# EAGLE design SUSTAINA-Power-Distribution-Board (EAGLE 9.6.2)
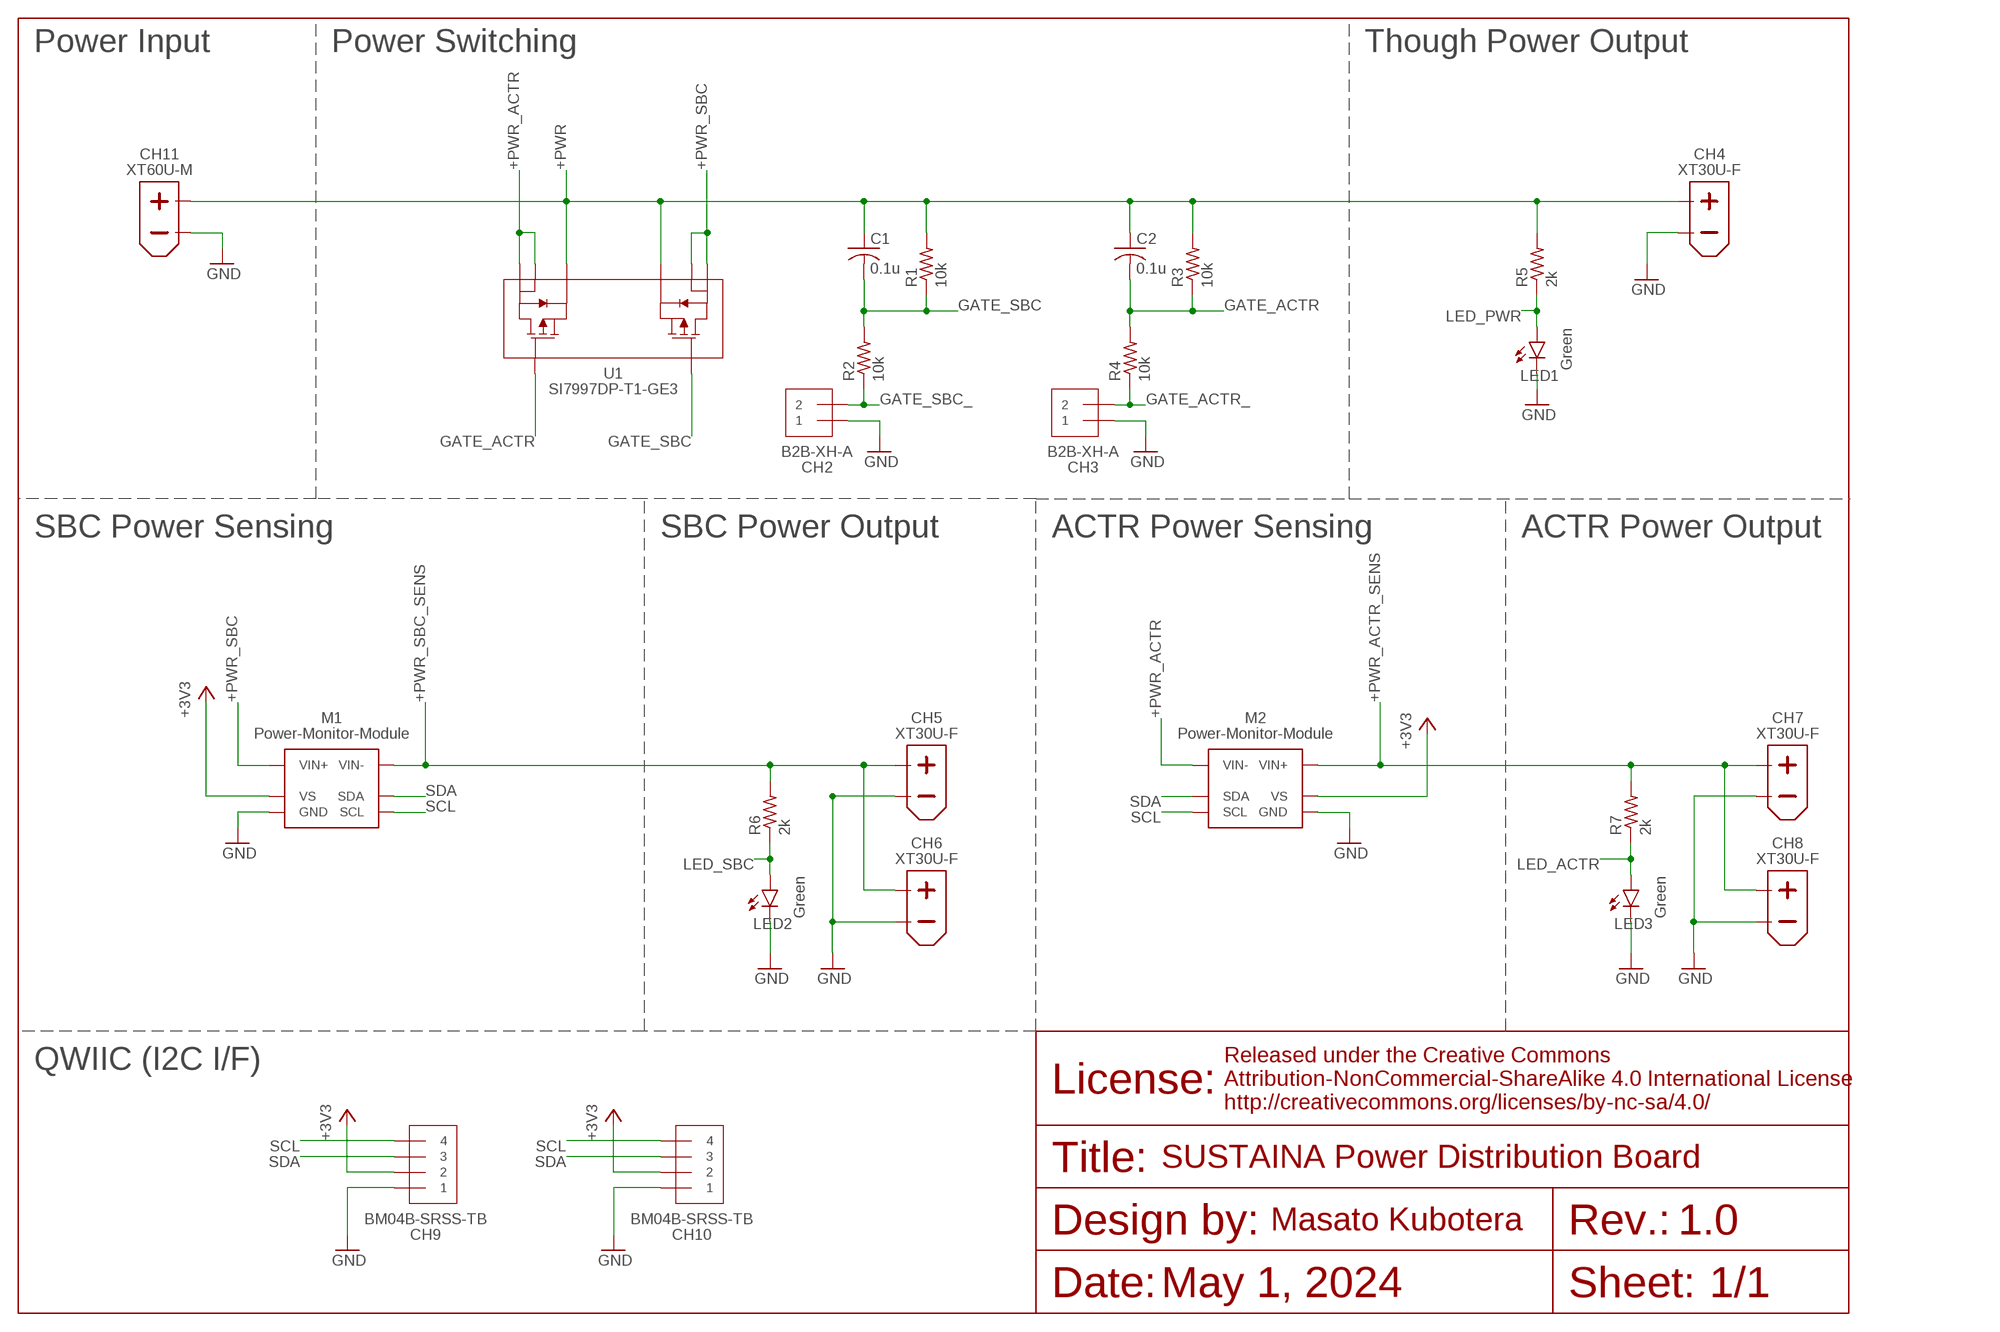
[diagram p0: schematic, sheet 1]

## Parts
C1  0.1u  C-USC0603  [C0603]
C2  0.1u  C-USC0603  [C0603]
CH2  B2B-XH-A  [B2B-XH-A]
CH3  B2B-XH-A  [B2B-XH-A]
CH4  XT30U-F  [XT30U-F]
CH5  XT30U-F  [XT30U-F]
CH6  XT30U-F  [XT30U-F]
CH7  XT30U-F  [XT30U-F]
CH8  XT30U-F  [XT30U-F]
CH9  BM04B-SRSS-TB  [BM04B-SRSS-TB]
CH10  BM04B-SRSS-TB  [BM04B-SRSS-TB]
CH11  XT60U-M  [XT60U-M]
LED1  Green  LEDSML0603  [SML0603]
LED2  Green  LEDSML0603  [SML0603]
LED3  Green  LEDSML0603  [SML0603]
M1  POWER-MONITOR-MODULE  [POWER-MONITOR-MODULE]
M2  POWER-MONITOR-MODULE  [POWER-MONITOR-MODULE]
R1  10k  R-US_R0603  [R0603]
R2  10k  R-US_R0603  [R0603]
R3  10k  R-US_R0603  [R0603]
R4  10k  R-US_R0603  [R0603]
R5  2k  R-US_R0603  [R0603]
R6  2k  R-US_R0603  [R0603]
R7  2k  R-US_R0603  [R0603]
U1  SI7997DP-T1-GE3  [POWERPAK_SO-8_VIS]

## Nets
+3V3 [low-power]: CH9.2 CH10.2 M1.VS M2.VS
+PWR [power]: C1.1 C2.1 CH4.+ CH11.+ R1.2 R3.2 R5.2 U1.1(S1) U1.3(S2)
+PWR_ACTR [power]: M2.VIN-1(VIN-) M2.VIN-2(VIN-) M2.VIN-3(VIN-) M2.VIN-4(VIN-) M2.VIN-5(VIN-) M2.VIN-6(VIN-) M2.VIN-7(VIN-) M2.VIN-8(VIN-) M2.VIN-9(VIN-) M2.VIN-10(VIN-) U1.7(D1) U1.8(D1_2)
+PWR_ACTR_SENS [power]: CH7.+ CH8.+ M2.VIN+1(VIN+) M2.VIN+2(VIN+) M2.VIN+3(VIN+) M2.VIN+4(VIN+) M2.VIN+5(VIN+) M2.VIN+6(VIN+) M2.VIN+7(VIN+) M2.VIN+8(VIN+) M2.VIN+9(VIN+) M2.VIN+10(VIN+) R7.2
+PWR_SBC [power]: M1.VIN+1(VIN+) M1.VIN+2(VIN+) M1.VIN+3(VIN+) M1.VIN+4(VIN+) M1.VIN+5(VIN+) M1.VIN+6(VIN+) M1.VIN+7(VIN+) M1.VIN+8(VIN+) M1.VIN+9(VIN+) M1.VIN+10(VIN+) U1.5(D2) U1.6(D2_2)
+PWR_SBC_SENS [power]: CH5.+ CH6.+ M1.VIN-1(VIN-) M1.VIN-2(VIN-) M1.VIN-3(VIN-) M1.VIN-4(VIN-) M1.VIN-5(VIN-) M1.VIN-6(VIN-) M1.VIN-7(VIN-) M1.VIN-8(VIN-) M1.VIN-9(VIN-) M1.VIN-10(VIN-) R6.2
GATE_ACTR [power_signal]: C2.2 R3.1 R4.2 U1.2(G1)
GATE_ACTR_ [power_signal]: CH3.2 R4.1
GATE_SBC [power_signal]: C1.2 R1.1 R2.2 U1.4(G2)
GATE_SBC_ [power_signal]: CH2.2 R2.1
GND [power]: CH2.1 CH3.1 CH4.- CH5.- CH6.- CH7.- CH8.- CH9.1 CH10.1 CH11.- LED1.C LED2.C LED3.C M1.GND M2.GND
LED_ACTR [low-power]: LED3.A R7.1
LED_PWR [low-power]: LED1.A R5.1
LED_SBC [low-power]: LED2.A R6.1
SCL [signal]: CH9.4 CH10.4 M1.SCL M2.SCL
SDA [signal]: CH9.3 CH10.3 M1.SDA M2.SDA

## Notes on the sheet
- Power Input | Power Switching | Though Power Output
- SBC Power Sensing | SBC Power Output | ACTR Power Sensing | ACTR Power Output
- QWIIC (I2C I/F)
- SUSTAINA Power Distribution Board
- 1.0
- May 1, 2024 | 1/1

## Library data of the parts
C1 C2 = rcl:C-US: CAPACITOR, American symbol; SPICEPREFIX: C
CH2 CH3 = JST-XH:B2B-XH-A
CH4-CH8 = XT30:XT30U-F
CH9 CH10 = SH-Connecters:BM04B-SRSS-TB
CH11 = XT60:XT60U-M
LED1-LED3 = led:LED: LED OSRAM: - CHIPLED LG R971, LG N971, LY N971, LG Q971, LY Q971, LO R971, LY R971 LH N974, LH R974 LS Q976, LO Q976, LY Q976 LO Q996 - Hyper CHIPLED LW Q18S LB Q993, LB Q99A, LB R99A - SideLED LS A670, LO A670, LY A670, LG A670, LP A670 LB A673, LV A673, LT A673, LW A673 LH A674 LY A675 LS A676, LA A676, LO A676, LY A676, LW A676 LS A679, LY A679, LG A679 - Hyper Micro SIDELED® LS Y876, LA Y876, LO Y876, LY Y876 LT Y87S - SmartLED LW L88C, LW L88S LB L89C, LB L89S, LG L890 LS L89K, LO L89K, LY L89K LS L896, LA L896, LO L896, LY L896 - TOPLED LS T670, LO T670, LY T670, LG T670, LP T670 LSG T670, LSP T670, LSY T670, LOP T670, LYG T670 LG T671, LOG T671, LSG T671 LB T673, LV T673, LT T673, LW T673 LH T674 LS T676, LA T676, LO T676, LY T676, LB T676, LH T676, LSB T676, LW T676 LB T67C, LV T67C, LT T67C, LS T67K, LO T67K, LY T67K, LW E67C LS E67B, LA E67B, LO E67B, LY E67B, LB E67C, LV E67C, LT E67C LW T67C LS T679, LY T679, LG T679 LS T770, LO T770, LY T770, LG T770, LP T770 LB T773, LV T773, LT T773, LW T773 LH T774 LS E675, LA E675, LY E675, LS T675 LS T776, LA T776, LO T776, LY T776, LB T776 LHGB T686 LT T68C, LB T68C - Hyper Mini TOPLED® LB M676 - Mini TOPLED Santana® LG M470 LS M47K, LO M47K, LY M47K Source: http://www.osram.convergy.de LUXEON: - LUMILED® LXK2-PW12-R00, LXK2-PW12-S00, LXK2-PW14-U00, LXK2-PW14-V00 LXK2-PM12-R00, LXK2-PM12-S00, LXK2-PM14-U00 LXK2-PE12-Q00, LXK2-PE12-R00, LXK2-PE12-S00, LXK2-PE14-T00, LXK2-PE14-U00 LXK2-PB12-K00, LXK2-PB12-L00, LXK2-PB12-M00, LXK2-PB14-N00, LXK2-PB14-P00, LXK2-PB14-Q00 LXK2-PR12-L00, LXK2-PR12-M00, LXK2-PR14-Q00, LXK2-PR14-R00 LXK2-PD12-Q00, LXK2-PD12-R00, LXK2-PD12-S00 LXK2-PH12-R00, LXK2-PH12-S00 LXK2-PL12-P00, LXK2-PL12-Q00, LXK2-PL12-R00 Source: www.luxeon.com KINGBRIGHT: KA-3528ASYC Source: www.kingbright.com
M1 M2 = Power-Monitor-Module:POWER-MONITOR-MODULE
R1-R7 = rcl:R-US_: RESISTOR, American symbol; SPICEPREFIX: R
U1 = SI7997DP-T1-GE3:SI7997DP-T1-GE3; COPYRIGHT: Copyright (C) 2024 Ultra Librarian. All rights reserved.; MANUFACTURER_PART_NUMBER: SI7997DP-T1-GE3; MFR_NAME: Vishay

## Net classes
1 signal: width 0.203 mm, clearance 0.127 mm
2 power: width 0.254 mm, clearance 0.127 mm
3 low-power: width 0.254 mm
4 power_signal: width 0.203 mm, clearance 0.127 mm

## Board
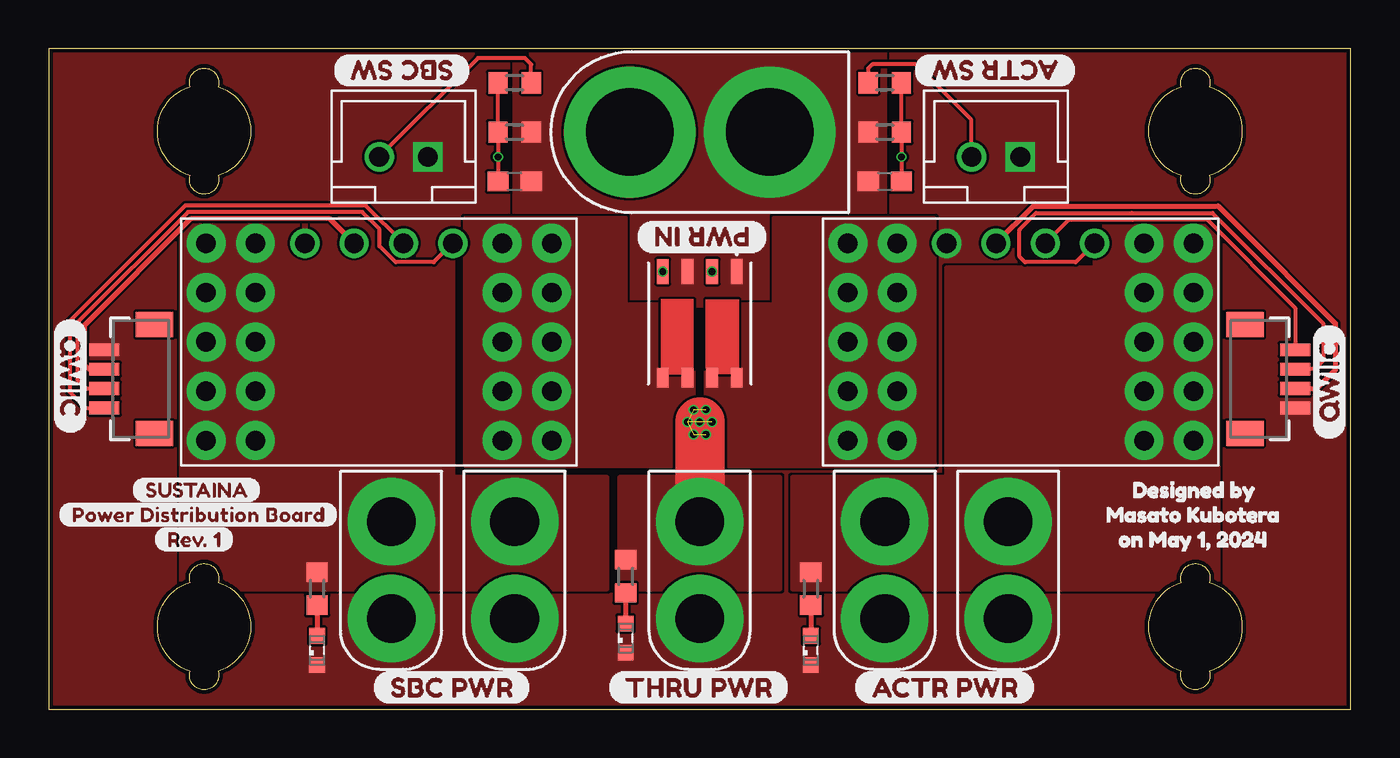
[diagram p1: board, top side]
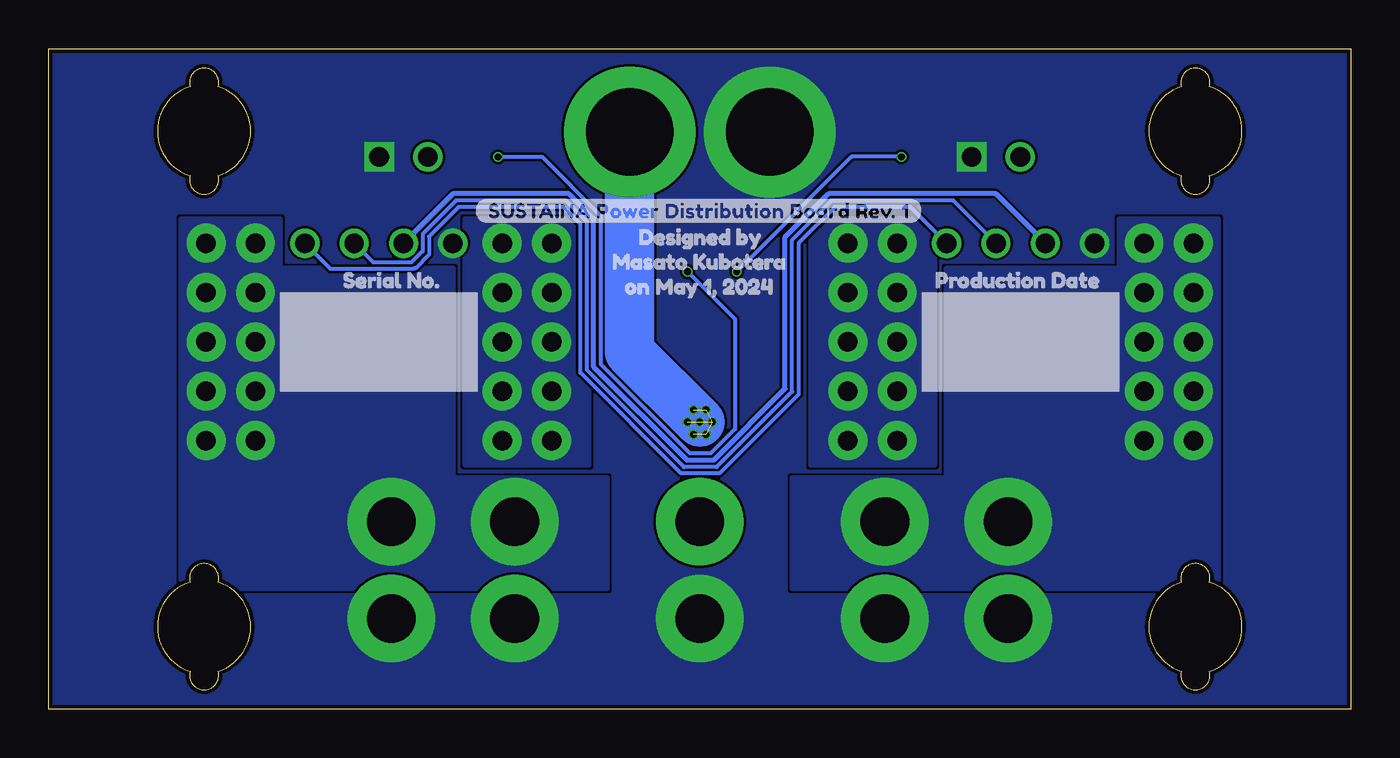
[diagram p2: board, bottom side, seen from below]

Size 67 x 34 mm. Coordinates in mm from the lower left corner, seen from the top.
Outline: 67,34 0,34 0,0 67,0 67,34
Outline: 8.72,1.96 arc-213 7.28,1.96 arc-145 7.28,6.54 arc-213 8.72,6.54 arc-145 8.72,1.96
Outline: 59.72,1.96 arc-213 58.28,1.96 arc-145 58.28,6.54 arc-213 59.72,6.54 arc-145 59.72,1.96
Outline: 58.28,32.04 arc-213 59.72,32.04 arc-145 59.72,27.46 arc-213 58.28,27.46 arc-145 58.28,32.04
Outline: 7.28,32.04 arc-213 8.72,32.04 arc-145 8.72,27.46 arc-213 7.28,27.46 arc-145 7.28,32.04
Copper layers (1*16): Top 0.035mm / dielectric 1.6mm / Bottom 0.035mm
Design rules "jlcpcb-2layers *": minimum track width 5mil, minimum drill 0.3mm, track to track 5mil, track to pad 5mil, pad to pad 5mil, via to via 5mil, smd to smd 5mil, copper to edge 0.2mm, drill to drill 6mil, minimum pad ring 10mil, minimum via ring 3mil, stop-mask expansion 4mil, vias tented up to drill 0mil, thermal gap 10mil

### Footprints (pad centres in the part's own frame; a part is rotated, then mirrored left to right if it is on the bottom)
C0603 = smd 1.1 x 1: 1 -0.85,0; 2 0.85,0
B2B-XH-A = drill 1.016 square: 1 -1.25,0 | drill 1.016: 2 1.25,0
XT30U-F = drill 2.5 pad 4.5: + 2.5,0; - -2.5,0
BM04B-SRSS-TB = smd 0.66 x 1.549: 1 1.5,3.33; 2 0.5,3.33; 3 -0.5,3.33; 4 -1.5,3.33 | smd 1.295 x 1.905: 5 2.8,0.75; 6 -2.8,0.75
XT60U-M = drill 4.5 pad 6.5: + 3.6,0; - -3.6,0
SML0603 = smd 0.8 x 0.8: A 0.75,0; C -0.75,0
POWER-MONITOR-MODULE = drill 1: GND 13.97,-11.43; SCL 8.89,-11.43; SDA 6.35,-11.43; VS 11.43,-11.43 | drill 1 pad 2: VIN+1 1.27,-1.27; VIN+2 3.81,-1.27; VIN+3 1.27,-3.81; VIN+4 3.81,-3.81; VIN+5 1.27,-6.35; VIN+6 3.81,-6.35; VIN+7 1.27,-8.89; VIN+8 3.81,-8.89; VIN+9 1.27,-11.43; VIN+10 3.81,-11.43; VIN-1 16.51,-1.27; VIN-2 19.05,-1.27; VIN-3 16.51,-3.81; VIN-4 19.05,-3.81; VIN-5 16.51,-6.35; VIN-6 19.05,-6.35; VIN-7 16.51,-8.89; VIN-8 19.05,-8.89; VIN-9 16.51,-11.43; VIN-10 19.05,-11.43
R0603 = smd 1 x 1.1: 1 -0.85,0; 2 0.85,0
POWERPAK_SO-8_VIS = smd 1.27 x 0.61: 1 -2.67,1.905; 2 -2.67,0.635; 3 -2.67,-0.635; 4 -2.67,-1.905 | smd 1.016 x 0.61: 5 2.797,-1.905; 6 2.797,-0.635; 7 2.797,0.635; 8 2.797,1.905

### Placement (x,y rotation side)
C1  23.98,27.16 180 top
C2  43.02,27.16 0 top
CH2  18.26,28.43 180 top
CH3  48.74,28.43 180 top
CH4  33.5,7.16 90 top
CH5  17.62,7.16 90 top
CH6  23.98,7.16 90 top
CH7  43.02,7.16 90 top
CH8  49.38,7.16 90 top
CH9  6.2,17 90 top
CH10  60.8,17 270 top
CH11  33.5,29.7 0 top
LED1  29.69,3.66 90 top
LED2  13.82,3.03 90 top
LED3  39.22,3.03 90 top
M1  27.15,12.55 180 top
M2  60.17,12.55 180 top
R1  23.98,29.7 0 top
R2  23.98,32.24 180 top
R3  43.02,29.7 180 top
R4  43.02,32.24 0 top
R5  29.69,6.84 90 top
R6  13.82,6.21 90 top
R7  39.22,6.21 90 top
U1  33.5,19.86 270 top
U$1  [QWIIC]  1.12,20.18 270 top
U$2  [ACTR_SW]  52.87,32.88 180 top
U$3  [SBC_SW]  21.75,32.88 180 top
U$4  [ACTR_PWR]  41.44,1.12 0 top
U$5  [THRU_PWR]  28.74,1.12 0 top
U$6  [SBC_PWR]  16.67,1.12 0 top
U$7  [PWR_IN]  36.99,24.3 180 top
U$8  [QWIIC]  65.88,13.82 90 top
U$9  [PRODUCTION_DATE-0.03]  22.07,22.08 0 bottom
U$10  [SUSTAINA_POWER_DISTRIBUTION_BOARD_REV#_1-0.03]  45.09,25.65 0 bottom
U$11  [DESIGNED_BY_MASATO_KUBOTERA_ON_MAY_1-COLUMN]  58.9,10.02 0 top
U$12  [DESIGNED_BY_MASATO_KUBOTERA_ON_MAY_1-COLUMN]  33.5,23.03 0 bottom
U$14  [REV#_1-0.03]  5.4,8.74 0 top
U$15  [SUSTAINA-0.03]  4.29,11.29 0 top
U$18  [POWER_DISTRIBUTION_BOARD-0.03]  0.48,10.02 0 top
U$19  [SERIAL_NO#-0.03]  52.55,22.08 0 bottom

### Tracks (layer width: path | path; a pad name or v marks a point on that pad's centre or on a via)
+3V3
  Top 0.254: M1.VS 14.47,25.24 7.32,25.24 1.84,19.76 1.84,17.75 2.08,17.5 CH9.2 | CH10.2 65.23,16.5 66.2,17.47 66.2,19.86 61.12,24.94 61.12,24.95 60.17,25.9 50.65,25.9 M2.VS
  Bottom 0.254: M1.VS 18.27,26.53 26.87,26.53 29.11,24.3 29.11,16.5 32.78,12.82 34.17,12.82 38.95,17.61 38.95,25.26 40.23,26.53 46.19,26.53 M2.VS
+PWR  (via drill 0.35)  (6 unrouted)
  Top 2.54: v33.5,14.78 CH4.+
  Bottom 2.54: CH11.+ 37.1,18.38 v33.5,14.78
  other vias: 32.87,14.78 33.18,15.41 33.82,15.41 34.13,14.78 33.82,14.14 33.18,14.14
  pour Top (rank 3, no thermals): 23.98,34.78 23.98,20.81 43.02,20.81 43.02,34.78
  pour Top (no thermals): 29.37,11.92 29.37,6.21 37.63,6.21 37.63,11.92
+PWR_ACTR
  pour Bottom (no thermals): 39.22,12.55 45.56,12.55 45.56,25.26 39.22,25.26
  pour Top (no thermals): 45.56,25.26 37.31,25.26 37.31,20.81 33.82,20.81 33.82,12.55 45.56,12.55
+PWR_ACTR_SENS
  pour Top (no thermals): 46.2,22.71 46.2,11.92 38.26,11.92 38.26,6.21 60.17,6.21 60.17,25.26 53.82,25.26 53.82,22.71
  pour Bottom (no thermals): 38.26,11.92 38.26,6.21 60.17,6.21 60.17,25.26 55.09,25.26 55.09,22.71 46.2,22.71 46.2,11.92
+PWR_SBC
  pour Top (no thermals): 21.44,25.26 21.44,12.55 33.18,12.55 33.18,20.81 29.69,20.81 29.69,25.26
  pour Bottom (no thermals): 21.44,12.55 27.79,12.55 27.79,25.26 21.44,25.26
+PWR_SBC_SENS
  pour Top (no thermals): 28.74,11.92 20.8,11.92 20.8,25.26 6.83,25.26 6.83,6.21 28.74,6.21
  pour Bottom (no thermals): 6.83,25.26 6.83,6.21 28.74,6.21 28.74,11.92 20.8,11.92 20.8,22.71 11.91,22.71 11.91,25.26
GATE_ACTR  (via drill 0.35)
  Top 0.203: C2.2 v43.88,28.43 R3.1 R4.2
  Bottom 0.203: v43.88,28.43 41.62,28.43 38.6,25.41 38.6,17.76 34.02,13.18 32.93,13.18 31.68,14.42 31.68,20.08 U1.2
  other vias: 34.13,22.53
GATE_ACTR_
  Top 0.203: R4.1 42.17,32.98 42.39,33.19 44.61,33.19 47.47,30.34 47.47,28.43 CH3.2
GATE_SBC  (via drill 0.35)
  Top 0.203: C1.2 v23.12,28.43 R1.1 R2.2
  Bottom 0.203: v23.12,28.43 25.69,28.43 U1.4
  other vias: 31.59,22.53
GATE_SBC_
  Top 0.203: R2.1 24.82,33.19 24.51,33.51 22.09,33.51 CH2.2
GND
  pour Top (rank 6, no thermals): -2.06,-3.32 69.06,-3.32 69.06,37.32 -2.06,37.32
  pour Bottom (rank 6, no thermals): -4.6,-5.86 71.6,-5.86 71.6,39.86 -4.6,39.86
LED_ACTR
  Top 0.254: R7.1 LED3.A
LED_PWR
  Top 0.254: R5.1 LED1.A
LED_SBC
  Top 0.254: R6.1 LED2.A
SCL
  Top 0.203: M2.SCL 52.5,25.2 55.84,25.2 55.85,25.21 59.58,25.21 64.14,20.66 CH10.4 | CH9.4 1.91,15.5 1.08,16.34 1.08,19.97 7.03,25.93 16.32,25.93 M1.SCL
  Bottom 0.203: M2.SCL 50.3,23 48.33,23 47.76,23.58 47.76,24.46 46.04,26.18 40.38,26.18 39.31,25.11 39.31,17.46 34.31,12.47 32.63,12.47 28.75,16.35 28.75,24.16 26.73,26.18 20.45,26.18 M1.SCL
SDA
  Top 0.203: 3.02,16.5 CH9.3 1.93,16.5 1.48,16.95 1.48,19.91 7.17,25.59 16.14,25.59 17.02,24.71 17.02,23.84 17.85,23 19.82,23 M1.SDA | M2.SDA 52.84,23 50.24,23 49.95,23.29 49.95,24.68 50.8,25.53 55.7,25.53 55.71,25.54 59.88,25.54 65.57,19.86 65.57,17.95 65.11,17.5 CH10.3
  Bottom 0.203: M2.SDA 52.51,22.67 48.2,22.67 48.15,22.71 48.11,22.71 47.43,23.39 47.43,24.33 45.91,25.85 40.52,25.85 39.64,24.97 39.64,17.32 34.45,12.14 32.49,12.14 28.42,16.21 28.42,23.98 26.56,25.85 22.66,25.85 M1.SDA